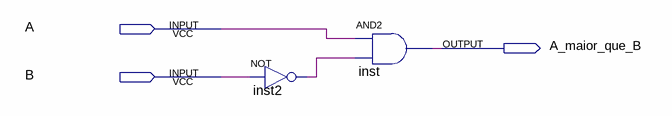
[diagram p0: schematic sheet]
// Quartus schematic Maior_1bit.bdf as structural Verilog: 2 symbols, 3 pins
module Maior_1bit (
  input  A,
  input  B,
  output A_maior_que_B
);

  wire inst2_out;

  not inst2 (inst2_out, B);
  and inst (A_maior_que_B, A, inst2_out);
endmodule
